# Altium project m10motor.PrjPCB
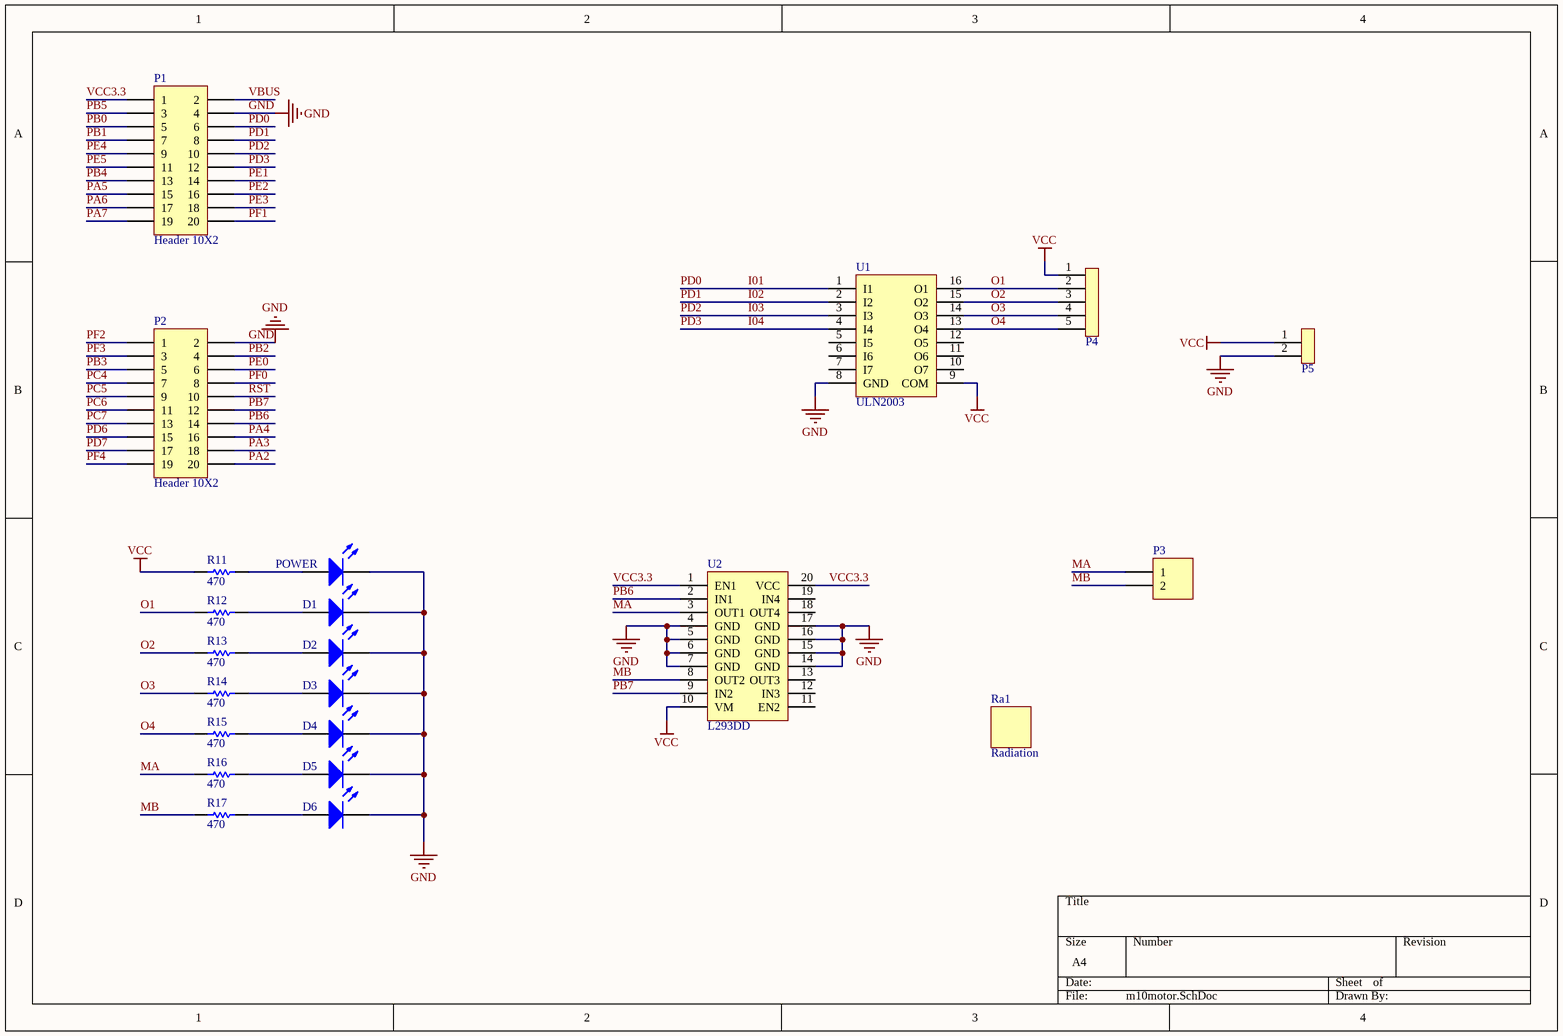
[diagram p0: m10motor.SchDoc]
1 sheet, 22 parts. Net scope: global (net labels, ports and power ports of the same name join across sheets).
Board file: m10motor.PcbDoc

## Sheet m10motor.SchDoc
size A4

### Parts
D1  LED2  [LED_0603_RED]  (value not drawn)
D2  LED2  [LED_0603_RED]  (value not drawn)
D3  LED2  [LED_0603_RED]  (value not drawn)
D4  LED2  [LED_0603_RED]  (value not drawn)
D5  LED2  [LED_0603_RED]  (value not drawn)
D6  LED2  [LED_0603_RED]  (value not drawn)
P1  Header 10X2  [HDR2X10]
P2  Header 10X2  [HDR2X10]
P3  Header 2  [MKDSN_2RMI]  (value not drawn)
P4  Header5  [XHP5]  (value not drawn)
P5  Header2  [MKDSN_2RMI]  (value not drawn)
POWER  LED2  [LED_0603_RED]  (value not drawn)
R11  value 470  [RES_0603]  (hidden comment: Res Semi)
R12  value 470  [RES_0603]  (hidden comment: Res Semi)
R13  value 470  [RES_0603]  (hidden comment: Res Semi)
R14  value 470  [RES_0603]  (hidden comment: Res Semi)
R15  value 470  [RES_0603]  (hidden comment: Res Semi)
R16  value 470  [RES_0603]  (hidden comment: Res Semi)
R17  value 470  [RES_0603]  (hidden comment: Res Semi)
Ra1  Radiation  [Radiation]
U1  ULN2003  [ULN2003A]
U2  L293DD  [SOP20]

### Nets
GND: D1.2(K) D2.2(K) D3.2(K) D4.2(K) D5.2(K) D6.2(K) P1.4 P2.2 P5.2 POWER.2(K) U1.8(GND) U2.4(GND) U2.5(GND) U2.6(GND) U2.7(GND) U2.14(GND) U2.15(GND) U2.16(GND) U2.17(GND)
VCC: P4.1 P5.1 R11.1 U1.9(COM) U2.10(VM)
I01: P1.6 U1.1(I1)  [also labelled PD0]
I02: P1.8 U1.2(I2)  [also labelled PD1]
I03: P1.10 U1.3(I3)  [also labelled PD2]
I04: P1.12 U1.4(I4)  [also labelled PD3]
MA: P3.1 R16.1 U2.3(OUT1)
MB: P3.2 R17.1 U2.8(OUT2)
O1: P4.2 R12.1 U1.16(O1)
O2: P4.3 R13.1 U1.15(O2)
O3: P4.4 R14.1 U1.14(O3)
O4: P4.5 R15.1 U1.13(O4)
PA2: P2.20
PA3: P2.18
PA4: P2.16
PA5: P1.15
PA6: P1.17
PA7: P1.19
PB0: P1.5
PB1: P1.7
PB2: P2.4
PB3: P2.5
PB4: P1.13
PB5: P1.3
PB6: P2.14 U2.2(IN1)
PB7: P2.12 U2.9(IN2)
PC4: P2.7
PC5: P2.9
PC6: P2.11
PC7: P2.13
PD6: P2.15
PD7: P2.17
PE0: P2.6
PE1: P1.14
PE2: P1.16
PE3: P1.18
PE4: P1.9
PE5: P1.11
PF0: P2.8
PF1: P1.20
PF2: P2.1
PF3: P2.3
PF4: P2.19
RST: P2.10
VBUS: P1.2
VCC3.3: P1.1 U2.1(EN1) U2.20(VCC)
NetD1_1: D1.1(A) R12.2
NetD2_1: D2.1(A) R13.2
NetD3_1: D3.1(A) R14.2
NetD4_1: D4.1(A) R15.2
NetD5_1: D5.1(A) R16.2
NetD6_1: D6.1(A) R17.2
NetPOWER_1: POWER.1(A) R11.2

Not connected (* = marked no-connect by the designer): U1 5(I5) 6(I6) 7(I7) 10(O7) 11(O6) 12(O5); U2 11(EN2) 12(IN3) 13(OUT3) 18(OUT4) 19(IN4)

### Library data of the parts
D1-D6 POWER = LED2: Typical RED, GREEN, YELLOW, AMBER GaAs LED; Published: 8-Jun-2000; LatestRevisionDate: 17-Jul-2002; LatestRevisionNote: Re-released for DXP Platform.; PackageVersion: Feb-2002; PackageReference: 3.2X1.6X1.1; Publisher: Altium Limited
P1 P2 = Header 10X2: Header, 10-Pin, Dual row; LatestRevisionDate: 17-Jul-2002; LatestRevisionNote: Re-released for DXP Platform.; Publisher: Altium Limited
P3 = Header 2: Header, 2-Pin; LatestRevisionDate: 17-Jul-2002; LatestRevisionNote: Re-released for DXP Platform.; Publisher: Altium Limited
R11-R17 = Res Semi: Semiconductor Resistor; Published: 8-Jun-2000; LatestRevisionDate: 17-Jul-2002; LatestRevisionNote: Re-released for DXP Platform.; PackageReference: AXIAL-0.5; Publisher: Altium Limited
U2 = L293DD: L293DD MOTOR